# Altium schematic sheet INTAN_Interface.SchDoc
size Tabloid; SheetNumber: 5; SheetTotal: 5; Sheet_Name: INTAN Interface; Size: 11x17
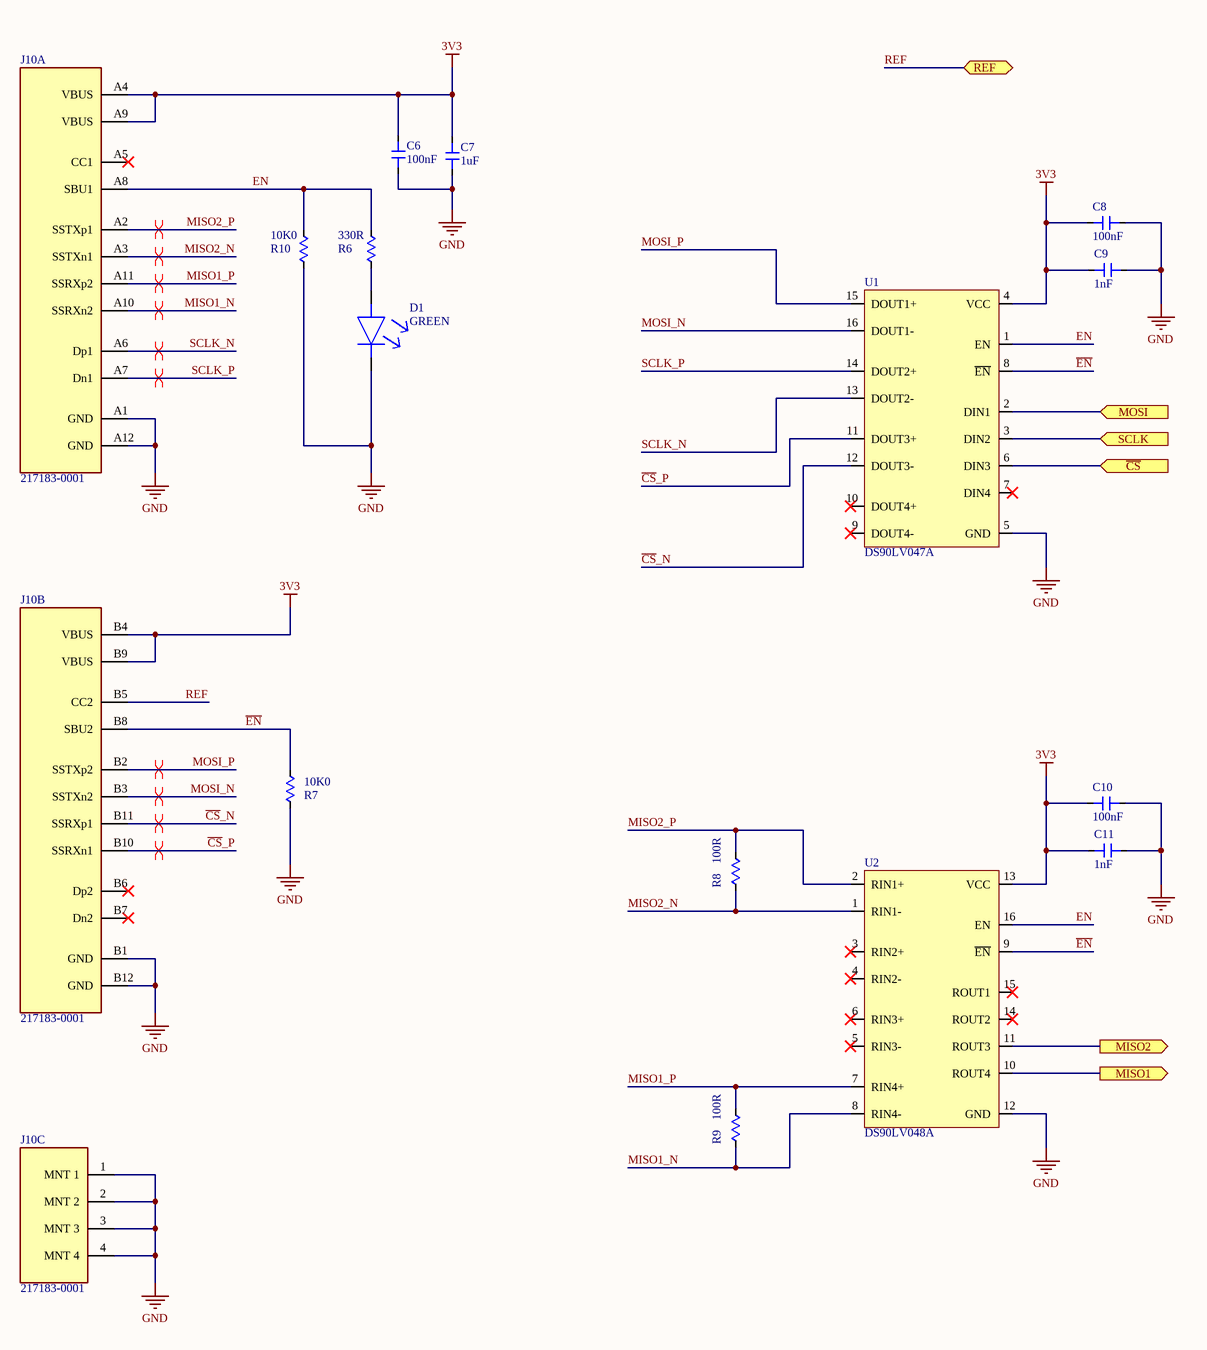
[diagram p0: INTAN_Interface.SchDoc]

## Parts
C6  100nF  [0603_CAPACITOR]
C7  1uF  [0603_CAPACITOR]
C8  100nF  [0603_CAPACITOR]
C9  1nF  [0603_CAPACITOR]
C10  100nF  [0603_CAPACITOR]
C11  1nF  [0603_CAPACITOR]
D1  GREEN  [LED_APT1608LZGCK]
J10  217183-0001  [CON_USB_C_SMD]  (parts A,B,C of 3)
R6  330R  [0603_RESISTOR]
R7  10K0  [0603_RESISTOR]
R8  100R  [0402_Resistor]
R9  100R  [0402_Resistor]
R10  10K0  [0603_RESISTOR]
U1  DS90LV047A  [TTSOP_16]
U2  DS90LV048A  [TTSOP_16]

## Ports
MISO1 (out), MISO2 (out), MOSI (in), REF (bidir), SCLK (in), ~{CS} (in)

## Nets
3V3: C6.2 C7.2 C8.1 C9.1 C10.1 C11.1 J10.A4(VBUS) J10.A9(VBUS) J10.B4(VBUS) J10.B9(VBUS) U1.4(VCC) U2.13(VCC)
GND: C6.1 C7.1 C8.2 C9.2 C10.2 C11.2 D1.1 J10.1(MNT_1) J10.2(MNT_2) J10.3(MNT_3) J10.4(MNT_4) J10.A1(GND) J10.A12(GND) J10.B1(GND) J10.B12(GND) R7.1 R10.1 U1.5(GND) U2.12(GND)
~{CS}: U1.6(DIN3) ; port ~{CS}
~{CS}_N: J10.B11(SSRXp1) U1.12(DOUT3-)
~{CS}_P: J10.B10(SSRXn1) U1.11(DOUT3+)
~{EN}: J10.B8(SBU2) R7.2 U1.8(~{EN}) U2.9(~{EN})
EN: J10.A8(SBU1) R6.2 R10.2 U1.1(EN) U2.16(EN)
MISO1: U2.10(ROUT4) ; port MISO1
MISO1_N: J10.A10(SSRXn2) R9.1 U2.8(RIN4-)
MISO1_P: J10.A11(SSRXp2) R9.2 U2.7(RIN4+)
MISO2: U2.11(ROUT3) ; port MISO2
MISO2_N: J10.A3(SSTXn1) R8.1 U2.1(RIN1-)
MISO2_P: J10.A2(SSTXp1) R8.2 U2.2(RIN1+)
MOSI: U1.2(DIN1) ; port MOSI
MOSI_N: J10.B3(SSTXn2) U1.16(DOUT1-)
MOSI_P: J10.B2(SSTXp2) U1.15(DOUT1+)
REF: J10.B5(CC2) ; port REF
SCLK: U1.3(DIN2) ; port SCLK
SCLK_N: J10.A6(Dp1) U1.13(DOUT2-)
SCLK_P: J10.A7(Dn1) U1.14(DOUT2+)
NetD1_2: D1.2 R6.1

Not connected (* = marked no-connect by the designer): J10 A5(CC1)* B6(Dp2)* B7(Dn2)*; U1 7(DIN4)* 9(DOUT4-)* 10(DOUT4+)*; U2 3(RIN2+)* 4(RIN2-)* 5(RIN3-)* 6(RIN3+)* 14(ROUT2)* 15(ROUT1)*

## Layout directives
differential pair: MISO1_N, MISO1_P, MISO2_N, MISO2_P, MOSI_N, MOSI_P, SCLK_N, SCLK_P, ~{CS}_N, ~{CS}_P

## Notes on the sheet
- Sheet Name
- Project Title
- Global Project
- Size
- Group
- Revision
- Date
- Sheet
- of
- Filename
- Designers

## Library data of the parts
C6-C11 = Capacitor
D1 = LED_GREEN: GREEN LED
J10 = CON_USBC_TH_SMT: USB-C (USB TYPE-C) USB 3.2 Gen 1 (USB 3.1 Gen 1, Superspeed (USB 3.0)) Receptacle Connector 24 Position Through Hole, Right Angle
R6-R10 = Resistor: GRAMS Lib Spec: 2.7
U1 = IC_LVDS_TX4: LVDS Transceiver 4 Channels with Enable
U2 = IC_LVDS_RX4: LVDS Receiver 4 Channels with Enable